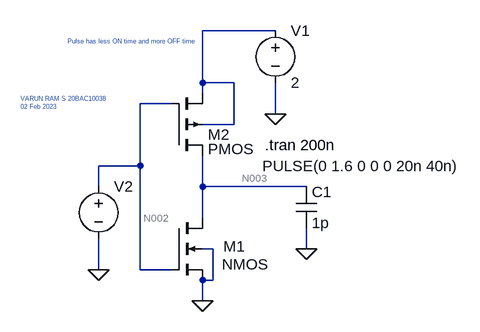
[diagram p0: schematic EXP2.asc]
EXP2.asc, the LTspice schematic file:
Version 4
SHEET 1 880 680
WIRE 352 -112 240 -112
WIRE 240 -32 240 -112
WIRE 288 -32 240 -32
WIRE 240 -16 240 -32
WIRE 192 0 144 0
WIRE 352 16 352 -32
WIRE 288 32 288 -32
WIRE 288 32 240 32
WIRE 144 96 144 0
WIRE 144 96 80 96
WIRE 80 128 80 96
WIRE 240 128 240 80
WIRE 400 128 240 128
WIRE 240 176 240 128
WIRE 256 224 240 224
WIRE 400 224 400 192
WIRE 80 256 80 208
WIRE 144 256 144 96
WIRE 192 256 144 256
WIRE 256 272 256 224
WIRE 256 272 240 272
WIRE 240 304 240 272
FLAG 80 256 0
FLAG 352 16 0
FLAG 400 224 0
FLAG 240 304 0
SYMBOL nmos4 192 176 R0
WINDOW 0 80 44 Left 2
WINDOW 3 78 72 Left 2
SYMATTR InstName M1
SYMATTR Value2 l=180n w=2u
SYMBOL voltage 352 -128 R0
WINDOW 123 0 0 Left 0
WINDOW 39 0 0 Left 0
SYMATTR InstName V1
SYMATTR Value 2
SYMBOL voltage 80 112 R0
WINDOW 3 252 -16 Left 2
WINDOW 123 0 0 Left 0
WINDOW 39 0 0 Left 0
SYMATTR Value PULSE(0 1.6 0 0 0 20n 40n)
SYMATTR InstName V2
SYMBOL cap 384 128 R0
SYMATTR InstName C1
SYMATTR Value 1p
SYMBOL pmos4 192 80 M180
WINDOW 3 56 10 Left 2
SYMATTR InstName M2
SYMATTR Value2 l=180n w=4u
TEXT 336 64 Left 2 !.tran 200n
TEXT 32 -96 Left 0 ;Pulse has less ON time and more OFF time
TEXT -40 -8 Left 0 ;VARUN RAM S 20BAC10038\n02 Feb 2023

The netlist it stands for:
* EXP2.asc
M1 N003 N002 0 0 NMOS l=180n w=2u
V1 N001 0 2
V2 N002 0 PULSE(0 1.6 0 0 0 20n 40n)
C1 N003 0 1p
M2 N003 N002 N001 N001 PMOS l=180n w=4u
.model NMOS NMOS
.model PMOS PMOS
.lib standard.mos
.tran 200n
* Pulse has less ON time and more OFF time
* VARUN RAM S 20BAC10038
* 02 Feb 2023
.backanno
.end

* Results of the author's LTspice run, read from the files saved beside the schematic
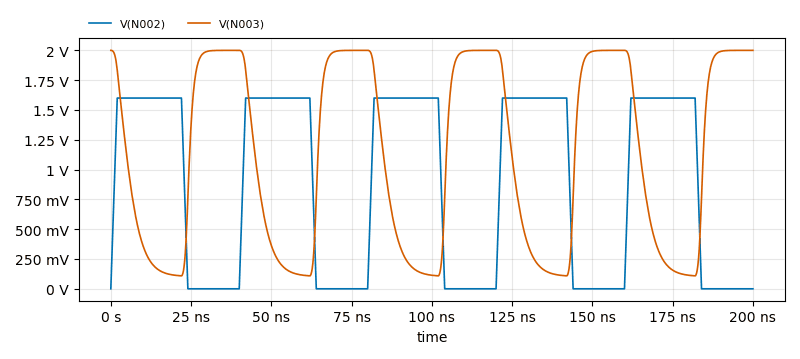
[diagram p1: Transient Analysis of EXP2.asc, plotted from the saved traces]
* Transient Analysis, 1 run:
*   V(N002): min 0 V, max 1.6 V, average 880 mV, rms 1.169 V, last 0 V
*   V(N003): min 108.6 mV, max 2 V, average 1.116 V, rms 1.377 V, last 2 V